# Altium schematic sheet lowpass-filters.SchDoc
size A3; SheetNumber: 1; SheetTotal: 6
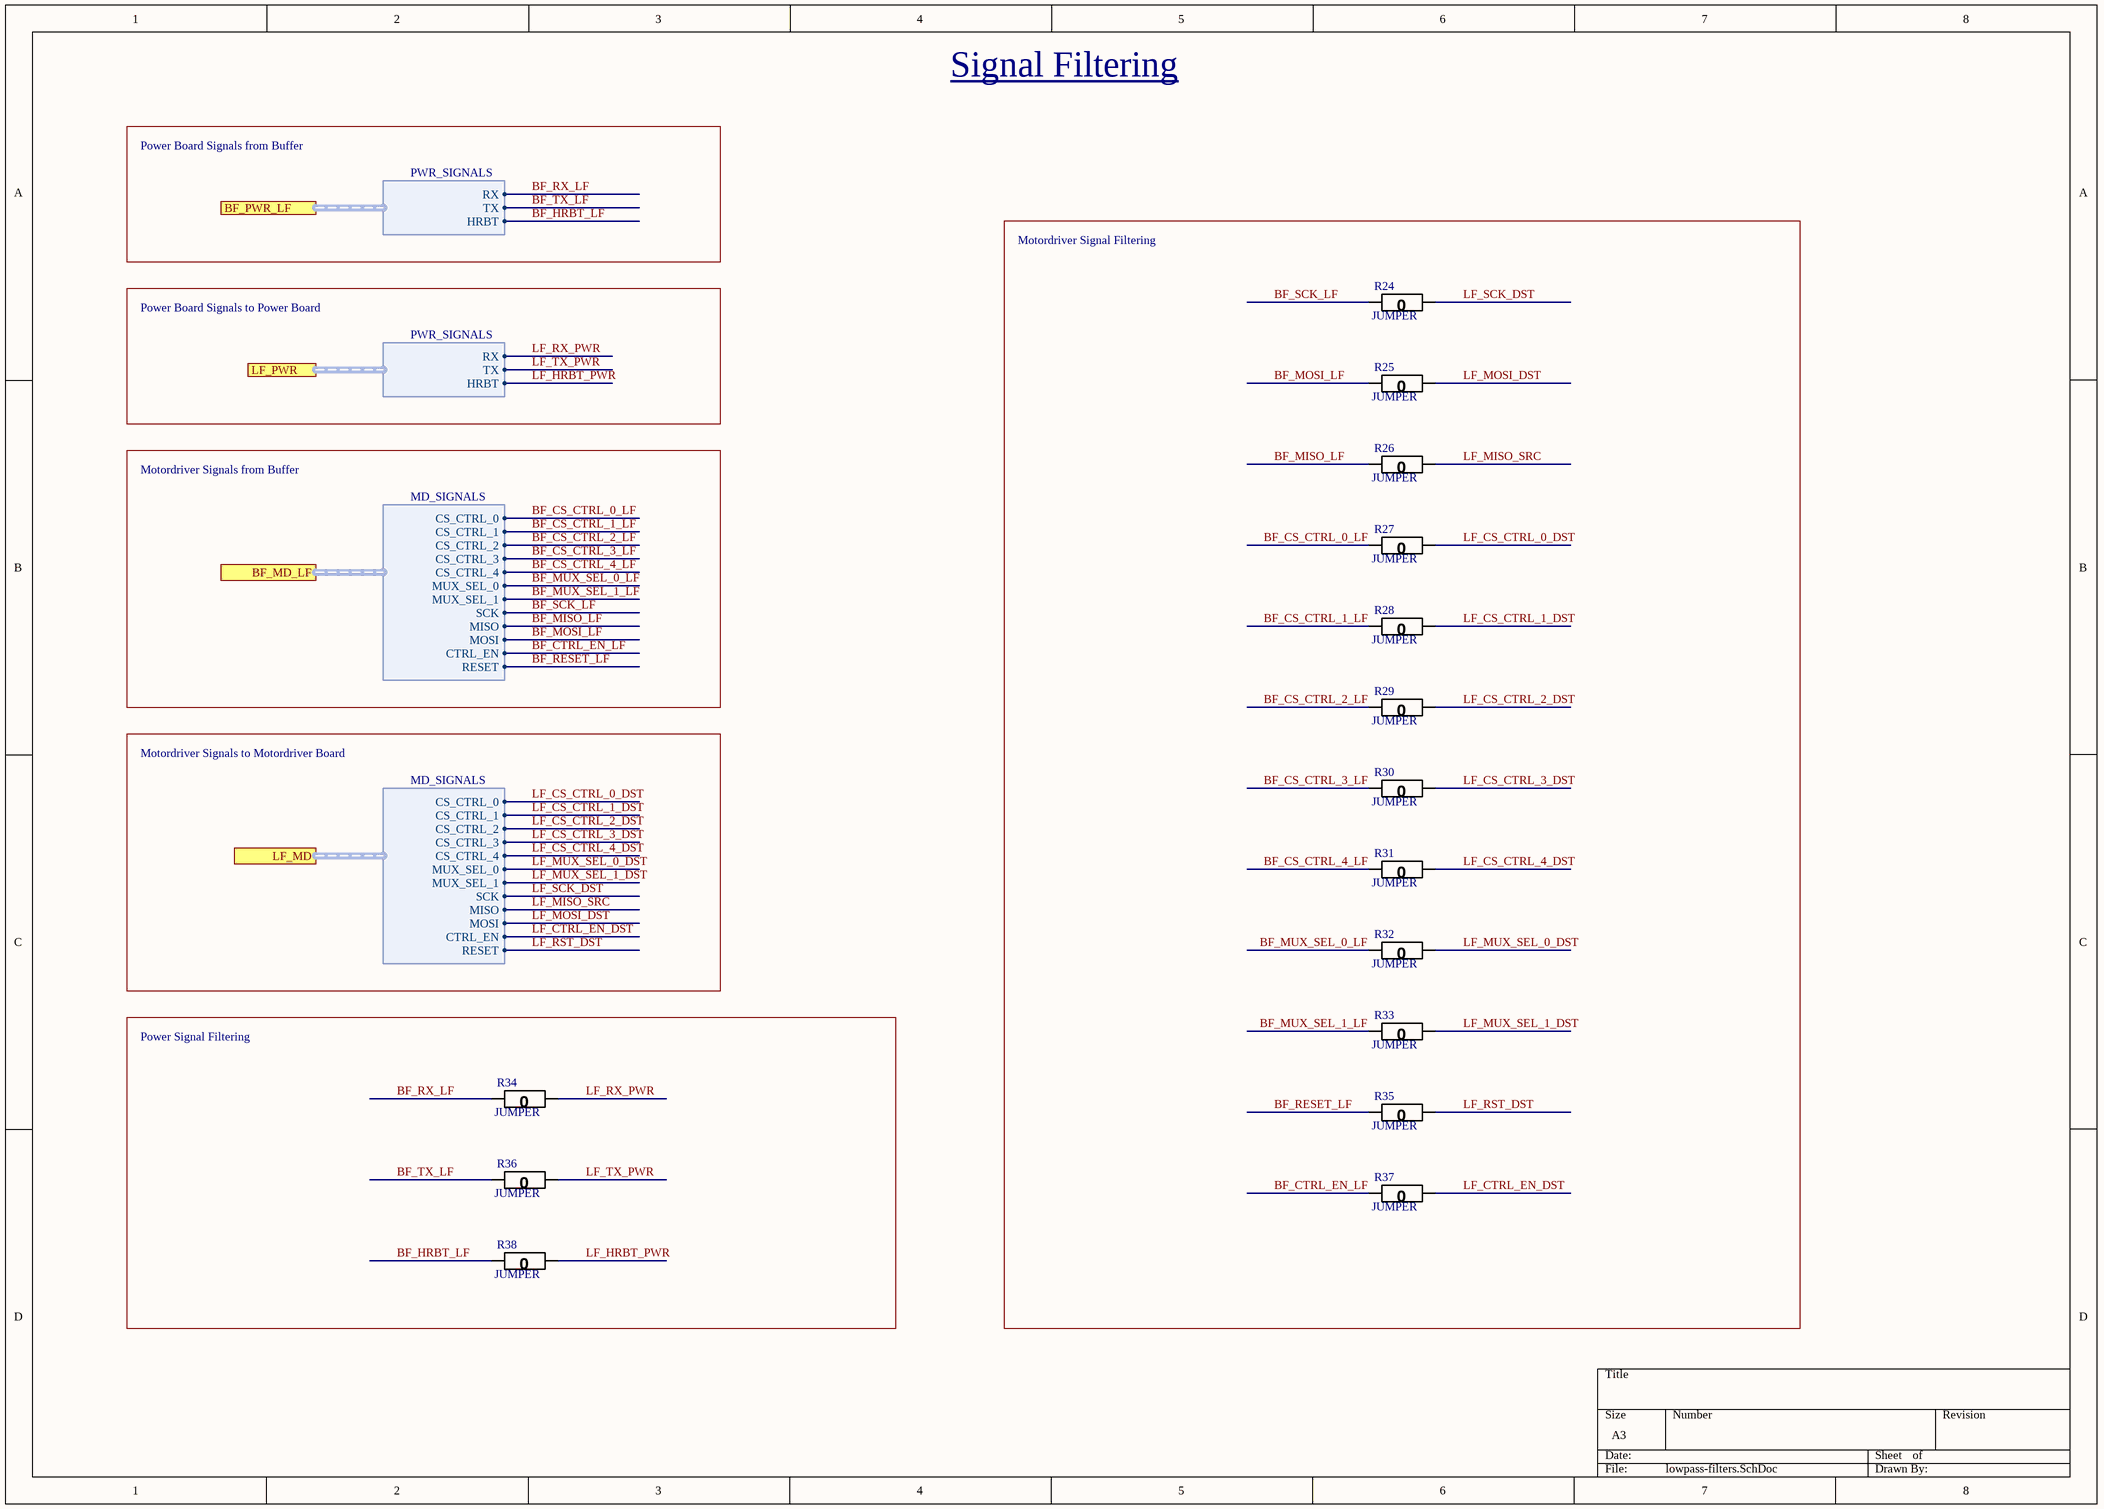
[diagram p0: lowpass-filters.SchDoc]

## Parts
R24  JUMPER  [0603]
R25  JUMPER  [0603]
R26  JUMPER  [0603]
R27  JUMPER  [0603]
R28  JUMPER  [0603]
R29  JUMPER  [0603]
R30  JUMPER  [0603]
R31  JUMPER  [0603]
R32  JUMPER  [0603]
R33  JUMPER  [0603]
R34  JUMPER  [0603]
R35  JUMPER  [0603]
R36  JUMPER  [0603]
R37  JUMPER  [0603]
R38  JUMPER  [0603]

## Blocks framed on the sheet
Motordriver Signal Filtering: R24-R33 R35 R37
Power Signal Filtering: R34 R36 R38

## Ports
BF_MD_LF (harness MD_SIGNALS), BF_PWR_LF (harness PWR_SIGNALS), LF_MD (harness MD_SIGNALS), LF_PWR (harness PWR_SIGNALS)

## Harnesses
PWR_SIGNALS: TX, RX, HRBT
MD_SIGNALS: CS_CTRL_0, MUX_SEL_1, SCK, MOSI, MISO, CS_CTRL_1, CS_CTRL_2, CS_CTRL_3, CS_CTRL_4, MUX_SEL_0, CTRL_EN, RESET

## Nets
BF_CS_CTRL_0_LF: R27.2(R2) ; port BF_MD_LF.CS_CTRL_0
BF_CS_CTRL_1_LF: R28.2(R2) ; port BF_MD_LF.CS_CTRL_1
BF_CS_CTRL_2_LF: R29.2(R2) ; port BF_MD_LF.CS_CTRL_2
BF_CS_CTRL_3_LF: R30.2(R2) ; port BF_MD_LF.CS_CTRL_3
BF_CS_CTRL_4_LF: R31.2(R2) ; port BF_MD_LF.CS_CTRL_4
BF_CTRL_EN_LF: R37.2(R2) ; port BF_MD_LF.CTRL_EN
BF_HRBT_LF: R38.2(R2) ; port BF_PWR_LF.HRBT
BF_MISO_LF: R26.2(R2) ; port BF_MD_LF.MISO
BF_MOSI_LF: R25.2(R2) ; port BF_MD_LF.MOSI
BF_MUX_SEL_0_LF: R32.2(R2) ; port BF_MD_LF.MUX_SEL_0
BF_MUX_SEL_1_LF: R33.2(R2) ; port BF_MD_LF.MUX_SEL_1
BF_RESET_LF: R35.2(R2) ; port BF_MD_LF.RESET
BF_RX_LF: R34.2(R2) ; port BF_PWR_LF.RX
BF_SCK_LF: R24.2(R2) ; port BF_MD_LF.SCK
BF_TX_LF: R36.2(R2) ; port BF_PWR_LF.TX
LF_CS_CTRL_0_DST: R27.1(R1) ; port LF_MD.CS_CTRL_0
LF_CS_CTRL_1_DST: R28.1(R1) ; port LF_MD.CS_CTRL_1
LF_CS_CTRL_2_DST: R29.1(R1) ; port LF_MD.CS_CTRL_2
LF_CS_CTRL_3_DST: R30.1(R1) ; port LF_MD.CS_CTRL_3
LF_CS_CTRL_4_DST: R31.1(R1) ; port LF_MD.CS_CTRL_4
LF_CTRL_EN_DST: R37.1(R1) ; port LF_MD.CTRL_EN
LF_HRBT_PWR: R38.1(R1) ; port LF_PWR.HRBT
LF_MISO_SRC: R26.1(R1) ; port LF_MD.MISO
LF_MOSI_DST: R25.1(R1) ; port LF_MD.MOSI
LF_MUX_SEL_0_DST: R32.1(R1) ; port LF_MD.MUX_SEL_0
LF_MUX_SEL_1_DST: R33.1(R1) ; port LF_MD.MUX_SEL_1
LF_RST_DST: R35.1(R1) ; port LF_MD.RESET
LF_RX_PWR: R34.1(R1) ; port LF_PWR.RX
LF_SCK_DST: R24.1(R1) ; port LF_MD.SCK
LF_TX_PWR: R36.1(R1) ; port LF_PWR.TX

## Notes on the sheet
- Signal Filtering
- Power Board Signals from Buffer
- Power Board Signals to Power Board
- Motordriver Signals from Buffer
- Motordriver Signals to Motordriver Board

## Library data of the parts
R24-R38 = RES 0 JUMPER: RES SMD 0 OHM JUMPER GENERIC 0603; Manufacturer Part Number 1: RK73Z1JTTD; Value: 0; Package: 0805; Part Number: RES 0 JUMPER; Tolerance: N/A; Supplier 1: Digi-Key; Supplier Part Number 1: 2019-RK73Z1JTTDCT-ND; Supplier URL 1: https://www.digikey.ca/en/products/detail/koa-speer-electronics-inc/RK73Z1JTTD/9845478